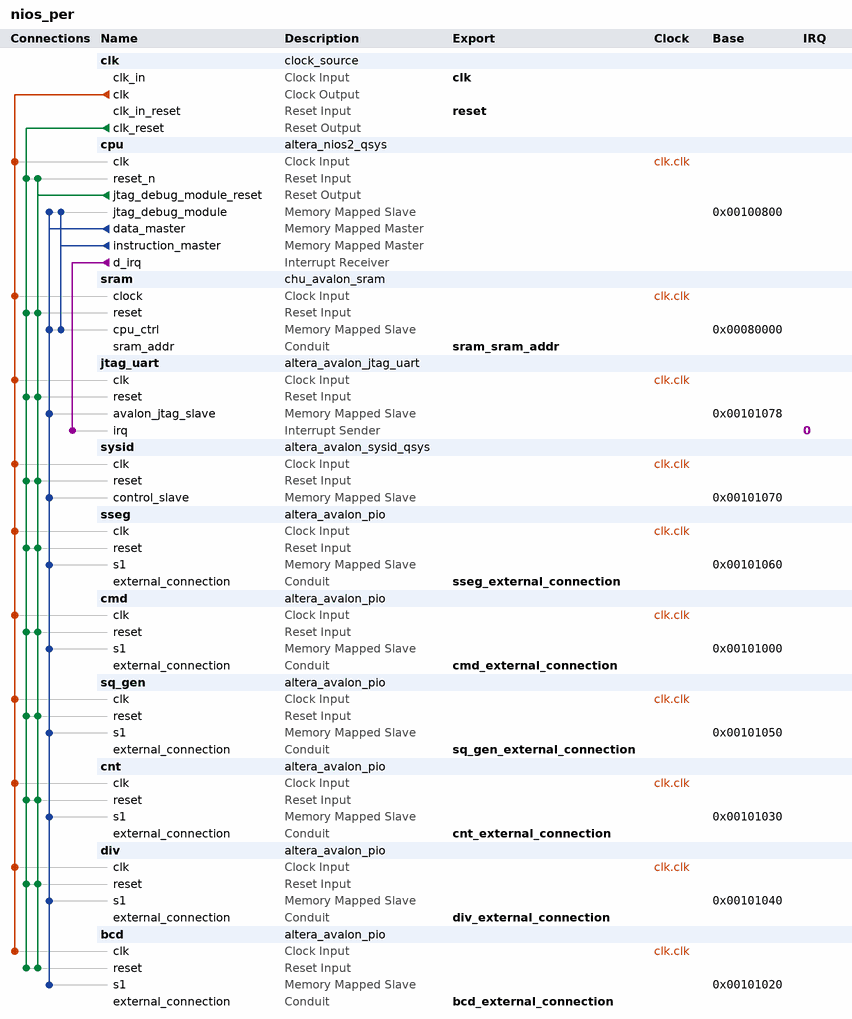
[diagram p0: system contents]
# Platform Designer (Qsys) system nios_per, Cyclone IV GX Unknown
# Parameters at their usual value, and those the tool derives, are not listed.
package require -exact qsys 13.0.1.99.2
create_system nios_per
set_project_property DEVICE_FAMILY {Cyclone IV GX}
set_project_property DEVICE Unknown

add_instance clk clock_source 13.0
set_instance_parameter_value clk clockFrequency 50000000

add_instance cpu altera_nios2_qsys 13.0
set_instance_parameter_value cpu resetSlave sram.cpu_ctrl
set_instance_parameter_value cpu mmu_TLBMissExcSlave None
set_instance_parameter_value cpu exceptionSlave sram.cpu_ctrl
set_instance_parameter_value cpu breakSlave cpu.jtag_debug_module
set_instance_parameter_value cpu impl Tiny
set_instance_parameter_value cpu icache_size 4096

add_instance sram chu_avalon_sram 1.0

add_instance jtag_uart altera_avalon_jtag_uart 13.0.1.99.2
set_instance_parameter_value jtag_uart simInteractiveOptions NO_INTERACTIVE_WINDOWS

add_instance sysid altera_avalon_sysid_qsys 13.0
set_instance_parameter_value sysid id 0

add_instance sseg altera_avalon_pio 13.0.1.99.2
set_instance_parameter_value sseg direction Output
set_instance_parameter_value sseg width 32

add_instance cmd altera_avalon_pio 13.0.1.99.2
set_instance_parameter_value cmd bitModifyingOutReg true
set_instance_parameter_value cmd direction Output
set_instance_parameter_value cmd width 4

add_instance sq_gen altera_avalon_pio 13.0.1.99.2
set_instance_parameter_value sq_gen direction Output
set_instance_parameter_value sq_gen width 26

add_instance cnt altera_avalon_pio 13.0.1.99.2
set_instance_parameter_value cnt captureEdge true
set_instance_parameter_value cnt direction Input
set_instance_parameter_value cnt width 22

add_instance div altera_avalon_pio 13.0.1.99.2
set_instance_parameter_value div captureEdge true
set_instance_parameter_value div direction Input
set_instance_parameter_value div width 22

add_instance bcd altera_avalon_pio 13.0.1.99.2
set_instance_parameter_value bcd captureEdge true
set_instance_parameter_value bcd direction Input
set_instance_parameter_value bcd width 18

# connections
add_connection clk.clk bcd.clk clock
add_connection clk.clk cmd.clk clock
add_connection clk.clk cnt.clk clock
add_connection clk.clk cpu.clk clock
add_connection clk.clk div.clk clock
add_connection clk.clk jtag_uart.clk clock
add_connection clk.clk sq_gen.clk clock
add_connection clk.clk sram.clock clock
add_connection clk.clk sseg.clk clock
add_connection clk.clk sysid.clk clock
add_connection clk.clk_reset bcd.reset reset
add_connection clk.clk_reset cmd.reset reset
add_connection clk.clk_reset cnt.reset reset
add_connection clk.clk_reset cpu.reset_n reset
add_connection clk.clk_reset div.reset reset
add_connection clk.clk_reset jtag_uart.reset reset
add_connection clk.clk_reset sq_gen.reset reset
add_connection clk.clk_reset sram.reset reset
add_connection clk.clk_reset sseg.reset reset
add_connection clk.clk_reset sysid.reset reset
add_connection cpu.jtag_debug_module_reset bcd.reset reset
add_connection cpu.jtag_debug_module_reset cmd.reset reset
add_connection cpu.jtag_debug_module_reset cnt.reset reset
add_connection cpu.jtag_debug_module_reset cpu.reset_n reset
add_connection cpu.jtag_debug_module_reset div.reset reset
add_connection cpu.jtag_debug_module_reset jtag_uart.reset reset
add_connection cpu.jtag_debug_module_reset sq_gen.reset reset
add_connection cpu.jtag_debug_module_reset sram.reset reset
add_connection cpu.jtag_debug_module_reset sseg.reset reset
add_connection cpu.jtag_debug_module_reset sysid.reset reset
add_connection cpu.data_master bcd.s1 avalon
set_connection_parameter_value cpu.data_master/bcd.s1 baseAddress 0x00101020
add_connection cpu.data_master cmd.s1 avalon
set_connection_parameter_value cpu.data_master/cmd.s1 baseAddress 0x00101000
add_connection cpu.data_master cnt.s1 avalon
set_connection_parameter_value cpu.data_master/cnt.s1 baseAddress 0x00101030
add_connection cpu.data_master cpu.jtag_debug_module avalon
set_connection_parameter_value cpu.data_master/cpu.jtag_debug_module baseAddress 0x00100800
add_connection cpu.data_master div.s1 avalon
set_connection_parameter_value cpu.data_master/div.s1 baseAddress 0x00101040
add_connection cpu.data_master jtag_uart.avalon_jtag_slave avalon
set_connection_parameter_value cpu.data_master/jtag_uart.avalon_jtag_slave baseAddress 0x00101078
add_connection cpu.data_master sq_gen.s1 avalon
set_connection_parameter_value cpu.data_master/sq_gen.s1 baseAddress 0x00101050
add_connection cpu.data_master sram.cpu_ctrl avalon
set_connection_parameter_value cpu.data_master/sram.cpu_ctrl baseAddress 0x00080000
add_connection cpu.data_master sseg.s1 avalon
set_connection_parameter_value cpu.data_master/sseg.s1 baseAddress 0x00101060
add_connection cpu.data_master sysid.control_slave avalon
set_connection_parameter_value cpu.data_master/sysid.control_slave baseAddress 0x00101070
add_connection cpu.instruction_master cpu.jtag_debug_module avalon
set_connection_parameter_value cpu.instruction_master/cpu.jtag_debug_module baseAddress 0x00100800
add_connection cpu.instruction_master sram.cpu_ctrl avalon
set_connection_parameter_value cpu.instruction_master/sram.cpu_ctrl baseAddress 0x00080000
add_connection cpu.d_irq jtag_uart.irq interrupt
set_connection_parameter_value cpu.d_irq/jtag_uart.irq irqNumber 0

# exported interfaces
add_interface clk clock sink
set_interface_property clk EXPORT_OF clk.clk_in
add_interface reset reset sink
set_interface_property reset EXPORT_OF clk.clk_in_reset
add_interface sram_sram_addr conduit end
set_interface_property sram_sram_addr EXPORT_OF sram.sram_addr
add_interface sseg_external_connection conduit end
set_interface_property sseg_external_connection EXPORT_OF sseg.external_connection
add_interface cmd_external_connection conduit end
set_interface_property cmd_external_connection EXPORT_OF cmd.external_connection
add_interface sq_gen_external_connection conduit end
set_interface_property sq_gen_external_connection EXPORT_OF sq_gen.external_connection
add_interface bcd_external_connection conduit end
set_interface_property bcd_external_connection EXPORT_OF bcd.external_connection
add_interface div_external_connection conduit end
set_interface_property div_external_connection EXPORT_OF div.external_connection
add_interface cnt_external_connection conduit end
set_interface_property cnt_external_connection EXPORT_OF cnt.external_connection

set_interconnect_requirement {$system} qsys_mm.clockCrossingAdapter HANDSHAKE
set_interconnect_requirement {$system} qsys_mm.maxAdditionalLatency 1

save_system nios_per.qsys
